# Altium schematic sheet USB.SchDoc
size A3; SheetNumber: 5; SheetTotal: 5
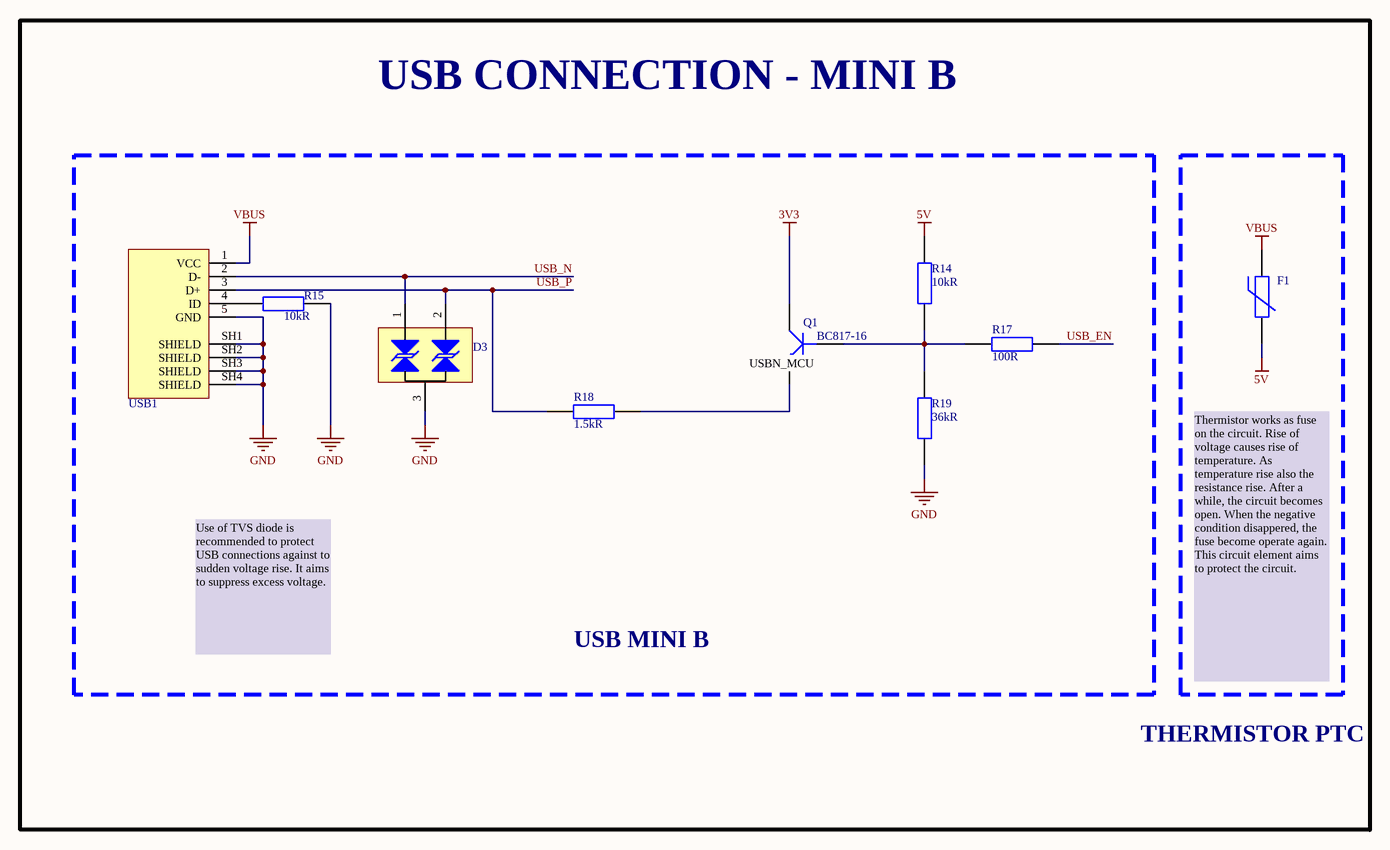
[diagram p0: USB.SchDoc]

## Parts
D3  SM712  [SOT-23]  (value not drawn)
F1  PRG21BC1R0MM1RA  [FUSE_0805]  (value not drawn)
Q1  BC817-16  [SOT23]
R14  Resistance: 10kR  [RES_0603]  (hidden comment: RC0603FR-0710KL)
R15  Resistance: 10kR  [RES_0603]  (hidden comment: RC0603FR-0710KL)
R17  Resistance: 100R  [RES_0603]  (hidden comment: RC0603JR-07100RL)
R18  Resistance: 1.5kR  [RES_0805]  (hidden comment: RC0805FR-071K5L)
R19  Resistance: 36kR  [RES_0805]  (hidden comment: RC0805FR-0736KL)
USB1  690-005-299-043  [MINI_USB_B]  (value not drawn)

## Blocks framed on the sheet
USB CONNECTION - MINI B: F1
USB MINI B: D3 Q1 R14 R15 R17-R19 USB1

## Nets
3V3: Q1.1(C)
5V: F1.2 R14.2
GND: D3.3 R15.2 R19.1 USB1.5(GND) USB1.SH1(SHIELD) USB1.SH2(SHIELD) USB1.SH3(SHIELD) USB1.SH4(SHIELD)
VBUS: F1.1 USB1.1(VCC)
USB_EN: R17.2
USB_N: D3.1 USB1.2(D-)
USB_P: D3.2 R18.1 USB1.3(D+)
NetQ1_2: Q1.2(B) R14.1 R17.1 R19.2
NetQ1_3: Q1.3(E) R18.2
NetR15_1: R15.1 USB1.4(ID)

## Notes on the sheet
- (near Q1) USBN_MCU
- Use of TVS diode is recommended to protect USB connections against to sudden voltage rise. It aims to suppress excess voltage.
- Thermistor works as fuse on the circuit. Rise of voltage causes rise of temperature. As temperature rise also the resistance rise. After a while, the circuit becomes open. When the negative condition disappered, the fuse become operate again.  This circuit element aims to protect the circuit.
- THERMISTOR PTC
- DOSYA ADI / FILE NAME
- TANIM / DESCRIPTION
- HAZIRLAYAN / PREPARED BY
- YAYIN TARİHİ / REL. DATE
- BOYUT / SIZE
- SAYFA / SHEET
- /

## Library data of the parts
D3 = SM712: 7V/12V Tvs, Package SOT-23, Tvs A; Manufacturer: Sangdest Microelectronics; DesignedBy: Aslı Kurt; Supplier 1: Digikey; Manufacturer Part Number: SM712; RoHS: No; Category: TVS Diodes; Stock 1: 85900; Pricing 1: 1=0,19, 10=0,132, 100=0,0887, 500=0,06778, 1000=0,06074 (USD); Supplier 2: Digikey; Stock 2: 84000; Pricing 2: 3000=0,05156, 6000=0,04684, 9000=0,04441, 15000=0,04165, 21000=0,04001, 30000=0,03841, 75000=0,03487, 150000=0,0339 (USD); Supplier Part Number 1: 1655-SM712CT-ND; Supplier Part Number 2: 1655-SM712TR-ND
F1 = PRG21BC1R0MM1RA: Thermistor PTC 1 Ohm 20% 2-Pin 0805 Surface Mount Solder Pad Embossed T/R; Manufacturer: Murata; DesignedBy: Aslı Kurt; Voltage Rating: 12V; Supplier 1: Mouser; Manufacturer Part Number: PRG21BC1R0MM1RA; RoHS: Yes; Category: Thermistors; Stock 1: 2720; Pricing 1: 1=0,62, 10=0,479, 50=0,479, 100=0,419, 1000=0,336, 10000=0,231 (USD); Lead Free: 5697LeadFree; ComponentLink1URL: https://datasheet.ciiva.com/30488/0900766b81259d6c-30488358.pdf?src-supplier=Rs; ComponentLink1Description: https://datasheet.ciiva.com/30488/0900766b81259d6c-30488358.pdf?src-supplier=Rs; ComponentLink2URL: https://datasheet.ciiva.com/327/ntc-ptcthermistorsforautomotive-327122.pdf?src-supplier=Digikey; ComponentLink2Description: https://datasheet.ciiva.com/327/ntc-ptcthermistorsforautomotive-327122.pdf?src-supplier=Digikey; ComponentLink3URL: https://datasheet.ciiva.com/29603/s0363e-29603286.pdf?src-supplier=Digikey; ComponentLink3Description: https://datasheet.ciiva.com/29603/s0363e-29603286.pdf?src-supplier=Digikey; ComponentLink4URL: https://datasheet.ciiva.com/29603/s0363e-29603287.pdf?src-supplier=Digikey; ComponentLink4Description: https://datasheet.ciiva.com/29603/s0363e-29603287.pdf?src-supplier=Digikey; ComponentLink5URL: https://datasheet.ciiva.com/29603/s0363e-29603289.pdf?src-supplier=Digikey; ComponentLink5Description: https://datasheet.ciiva.com/29603/s0363e-29603289.pdf?src-supplier=Digikey; ComponentLink6URL: https://datasheet.ciiva.com/3282/r90e-3282510.pdf?src-supplier=Avnet; ComponentLink6Description: https://datasheet.ciiva.com/3282/r90e-3282510.pdf?src-supplier=Avnet; Supplier 2: Arrow Electronics; Stock 2: 3860; Pricing 2: 387=0,3643, 1000=0,3353, 4000=0,2764 (USD); Supplier 3: Digikey; Stock 3: 24892; Pricing 3: 1=0,73, 5=0,612, 10=0,568, 25=0,5156, 50=0,4788, 100=0,4449, 500=0,37522, 1000=0,3487 (USD); Supplier 4: Digikey; Stock 4: 24892; Pricing 4: 1=0,73, 5=0,612, 10=0,568, 25=0,5156, 50=0,4788, 100=0,4449, 500=0,37522, 1000=0,3487 (USD); Supplier 5: Digikey; Stock 5: 24000; Pricing 5: 4000=0,23392, 8000=0,23138 (USD); Supplier Part Number 1: 81-PRG21BC1R0MM1RA; Supplier Part Number 2: PRG21BC1R0MM1RA; Supplier Part Number 3: 490-8511-1-ND; Supplier Part Number 4: 490-8511-6-ND; Supplier Part Number 5: 490-8511-2-ND
Q1 = BC817-16: ON Semi BC817-16LT1G NPN Bipolar Transistor; 0.5 A; 45 V; 3-Pin SOT-23; Manufacturer: ON Semiconductor; Max Collector Current: 500mA; Collector Base Voltage (VCBO): 50V; Emitter Base Voltage (VEBO): 5V; Collector Emitter Saturation Voltage: 700mV; Collector Emitter Breakdown Voltage: 45V; Max Power Dissipation: 300mW; Gain Bandwidth Product: 100MHz; Output Voltage: 15V; DesignedBy: Aslı Kurt; Supplier 1: Future Electronics; Manufacturer Part Number: BC817-16LT1G; RoHS: Yes; Category: BJTs; Stock 1: 63000; Pricing 1: 3000=0,0209, 12000=0,02, 30000=0,0147, 45000=0,0192, 75000=0,0143, 120000=0,0186, 300000=0,0177 (USD); Case/Package: SOT-23-3; Number of Pins: 3; Weight: 0.001058oz; Min Operating Temperature: -55°C; Max Operating Temperature: 150°C; Package Quantity: 3000; Packaging: Tape and Reel; Polarity: NPN; Collector-emitter Voltage-Max: 700mV; Series: -; Transition Frequency: 100MHz; Max Breakdown Voltage: 45V; Voltage Rating (DC): 45V; Current Rating: 500mA; Continuous Collector Current: 500mA; Length: 2.9mm; Width: 1.3mm; Height: 0.94mm; RoHS Compliant: Yes; Lead Free: Lead Free; Halogen Free: Halogen Free; Supplier 2: Avnet; Stock 2: 3965; Pricing 2: 1=0,158, 25=0,097, 50=0,079, 100=0,06, 250=0,052 (USD); Supplier 3: Arrow Electronics; Stock 3: 75000; Pricing 3: 3000=0,0223, 9000=0,016, 99000=0,0133 (USD); Supplier 4: Rs; Stock 4: 73400; Pricing 4: 1000=0,033, 2000=0,028 (GBP); Supplier 5: Rs; Stock 5: 2400; Pricing 5: 200=0,013, 1000=0,033, 2000=0,028 (GBP); Supplier 6: Digikey; Stock 6: 15878; Pricing 6: 1=0,1, 10=0,066, 100=0,0444, 500=0,03362, 1000=0,02993, 3000=0,02508, 6000=0,02256, 9000=0,02126, 15000=0,01978, 21000=0,0189, 30000=0,01803, 75000=0,01612, 150000=0,01492, 300000=0,0139 (USD); Supplier 7: Digikey; Stock 7: 16878; Pricing 7: 1=0,1, 10=0,066, 100=0,0444, 500=0,03362, 1000=0,02993 (USD); Supplier Part Number 1: 6937544; Supplier Part Number 2: 98H0503; Supplier Part Number 3: BC817-16LT1G; Supplier Part Number 4: 463616P; Supplier Part Number 5: 463616; Supplier Part Number 6: BC817-16LT1GOSCT-ND; Supplier Part Number 7: BC817-16LT1GOSDKR-ND
R14 R15 = RES 10K OHM 0603: RES 10K %1 OHM 0603 SMD; Manufacturer: Yageo; DesignedBy: Aslı Kurt; Tolerance: 1%; Temperature Coefficient: 100ppm/°C; Voltage Rating (DC): 50V; Power Rating: 100mW; Voltage Rating: 75V; Supplier 1: Digi-Key; Manufacturer Part Number: RC0603FR-0710KL; RoHS: Yes; Category: Chip SMD Resistors; Stock 1: 24140601; Pricing 1: 1=0,10000, 10=0,02300, 100=0,00930, 1000=0,00417, 2500=0,00362 (USD); Case/Package: 0603; Number of Pins: 2; Case Code (Imperial): 0603; Case Code (Metric): 1608; Weight: 7.1E-05oz; Size Code: 0603; Min Operating Temperature: -55°C; Max Operating Temperature: 155°C; Resistor Type: Thick Film; Packaging: Tape and Reel; Termination: SMD/SMT; Features: Moisture Resistant; Series: RC; Max Power Dissipation: 100mW; Number of Terminations: 2; Resistance Tolerance: 1%; Construction: Rectangular; Length: 1.6mm; Width: 0.8mm; Height: 0.45mm; Depth: 0.8mm; Lead Pitch: 0.3mm; REACH SVHC: Unknown; Lead Free: Lead Free; Military Standard: Not; RoHS Compliant: Yes; ComponentLink1URL: https://datasheet.ciiva.com/7660/38590-7660789.pdf?src-supplier=Element14; ComponentLink1Description: https://datasheet.ciiva.com/7660/38590-7660789.pdf?src-supplier=Element14; ComponentLink2URL: https://datasheet.ciiva.com/15189/getdatasheetpartid-409289-15189591.pdf?src-supplier=Verical; ComponentLink2Description: https://datasheet.ciiva.com/15189/getdatasheetpartid-409289-15189591.pdf?src-supplier=Verical; ComponentLink3URL: https://datasheet.ciiva.com/46440/1868787-46440891.pdf?src-supplier=Element14; ComponentLink3Description: https://datasheet.ciiva.com/46440/1868787-46440891.pdf?src-supplier=Element14; ComponentLink4URL: https://datasheet.ciiva.com/7983/443971-7983596.pdf?src-supplier=Element14; ComponentLink4Description: https://datasheet.ciiva.com/7983/443971-7983596.pdf?src-supplier=Element14; ComponentLink5URL: https://datasheet.ciiva.com/7746/1738695-7746239.pdf?src-supplier=Element14; ComponentLink5Description: https://datasheet.ciiva.com/7746/1738695-7746239.pdf?src-supplier=Element14; ComponentLink6URL: https://datasheet.ciiva.com/22747/443971-22747519.pdf?src-supplier=Element14; ComponentLink6Description: https://datasheet.ciiva.com/22747/443971-22747519.pdf?src-supplier=Element14; Supplier Part Number 1: 311-10.0KHRCT-ND
R17 = RES 100 OHM 0603: RES 100 %5 OHM 0603 SMD; Manufacturer: Yageo; DesignedBy: Aslı Kurt; Tolerance: 5%; Temperature Coefficient: 100ppm/°C; Voltage Rating (DC): 50V; Power Rating: 100mW; Supplier 1: Digi-Key; Manufacturer Part Number: RC0603JR-07100RL; RoHS: Yes; Category: Chip SMD Resistors; Stock 1: 4334796; Pricing 1: 1=0,10000, 10=0,01900, 100=0,00770, 1000=0,00344, 2500=0,00298 (USD); Case/Package: 0603; Number of Pins: 2; Contact Plating: Tin,Matte; Case Code (Imperial): 0603; Case Code (Metric): 1608; Size Code: 0603; Min Operating Temperature: -55°C; Max Operating Temperature: 155°C; Resistor Type: Thick Film; Packaging: Tape and Reel; Voltage Rating: 50V; Termination: SMD/SMT; Features: Moisture Resistant; Series: RC; Max Power Dissipation: 100mW; Number of Terminations: 2; Construction: Rectangular; Resistance Tolerance: 5%; Length: 1.6mm; Width: 0.8mm; Depth: 0.8mm; Radiation Hardening: No; REACH SVHC: Unknown; Lead Free: Lead Free; Military Standard: Not; RoHS Compliant: Yes; ComponentLink1URL: https://datasheet.ciiva.com/15189/getdatasheetpartid-325207-15189846.pdf?src-supplier=Verical; ComponentLink1Description: https://datasheet.ciiva.com/15189/getdatasheetpartid-325207-15189846.pdf?src-supplier=Verical; ComponentLink2URL: https://datasheet.ciiva.com/8883/pyu-rc0603-51-rohs-l-4-8883047.pdf?src-supplier=Avnet; ComponentLink2Description: https://datasheet.ciiva.com/8883/pyu-rc0603-51-rohs-l-4-8883047.pdf?src-supplier=Avnet; ComponentLink3URL: https://datasheet.ciiva.com/7746/443971-7746425.pdf?src-supplier=Element14; ComponentLink3Description: https://datasheet.ciiva.com/7746/443971-7746425.pdf?src-supplier=Element14; ComponentLink4URL: https://datasheet.ciiva.com/7746/443971-7746426.pdf?src-supplier=Element14; ComponentLink4Description: https://datasheet.ciiva.com/7746/443971-7746426.pdf?src-supplier=Element14; Supplier Part Number 1: 311-100GRCT-ND
R18 = RES 1K5 OHM 0805: SMD Chip Resistor, 1.5 kOhm, ï¿½ 1%, 125 mW, 0805 [2012 Metric], Thick Film, General Purpose; Manufacturer: Yageo; Temperature Coefficient: 100ppm/°C; Voltage Rating: 150V; Power Rating: 125mW; DesignedBy: Aslı Kurt; Supplier 1: Future Electronics; Manufacturer Part Number: RC0805FR-071K5L; RoHS: Yes; Category: Chip SMD Resistors; Stock 1: 1590000; Pricing 1: 5000=0,0041, 25000=0,0039, 100000=0,0038, 250000=0,0037, 625000=0,0035 (USD); Case/Package: 0805; Case Code (Imperial): 0805; Case Code (Metric): 2012; Size Code: 0805; Min Operating Temperature: -55°C; Max Operating Temperature: 155°C; Tolerance: 1%; Packaging: Tape and Reel; Resistor Type: Thick Film; Package Quantity: 5000; Termination: SMD/SMT; Series: RC; Voltage Rating (AC): 150V; Features: Moisture Resistant; Max Power Dissipation: 125mW; Number of Terminations: 2; Resistance Tolerance: 1%; Length: 2mm; Width: 1.25mm; Height: 0.5mm; Lead Free: Lead Free; Reach SVHC Compliant: Unknown; RoHS Compliant: Yes; ComponentLink1URL: https://datasheet.ciiva.com/17423/rc0805-17423247.pdf?src-supplier=Future+Electronics; ComponentLink1Description: https://datasheet.ciiva.com/17423/rc0805-17423247.pdf?src-supplier=Future+Electronics; Supplier 2: Avnet; Stock 2: 10000; Pricing 2: 5000=0,00207 (USD); Supplier 3: Farnell; Stock 3: 120909; Pricing 3: 500=0,0091, 1000=0,0072, 2500=0,0071 (EUR); Supplier 4: Rs; Stock 4: 13600; Pricing 4: 100=0,008, 1000=0,004, 2500=0,004, 5000=0,003, 10000=0,003 (GBP); Supplier 5: Mouser; Stock 5: 365697; Pricing 5: 1=0,1, 10=0,016, 50=0,016, 100=0,01, 1000=0,007, 10000=0,004 (USD); Supplier 6: Digikey; Stock 6: 528695; Pricing 6: 1=0,1, 10=0,016, 50=0,0132, 500=0,0102, 1000=0,00714 (USD); Supplier Part Number 1: 4797627; Supplier Part Number 2: RC0805FR-071K5L; Supplier Part Number 3: 9237518RL; Supplier Part Number 4: 1995669; Supplier Part Number 5: 603-RC0805FR-071K5L; Supplier Part Number 6: 311-1.50KCRDKR-ND
R19 = RES 36K OHM 0805: SMD Chip Resistor, 36 kOhm, ± 1%, 125 mW, 0805 [2012 Metric], Thick Film, General Purpose; Manufacturer: Yageo; Power Rating: 125mW; Voltage Rating: 150V; Temperature Coefficient: 100ppm/°C; DesignedBy: Aslı Kurt; Supplier 1: Future Electronics; Manufacturer Part Number: RC0805FR-0736KL; RoHS: Yes; Category: Chip SMD Resistors; Stock 1: 215000; Pricing 1: 5000=0,0031, 25000=0,0029, 100000=0,0028, 250000=0,0027, 625000=0,0026 (USD); Case/Package: 0805; Case Code (Imperial): 0805; Case Code (Metric): 2012; Min Operating Temperature: -55°C; Max Operating Temperature: 155°C; Tolerance: 1%; Packaging: Tape and Reel; Termination: SMD/SMT; Features: Moisture Resistant; Series: RC; Max Power Dissipation: 125mW; Number of Terminations: 2; Voltage Rating (DC): 150V; RoHS Compliant: Yes; Lead Free: 5697LeadFree; ComponentLink1URL: http://www.mouser.com/ds/2/447/Yageo_08112016_RC0805-968729.pdf?src-supplier=Mouser; ComponentLink1Description: http://www.mouser.com/ds/2/447/Yageo_08112016_RC0805-968729.pdf?src-supplier=Mouser; ComponentLink2URL: https://datasheet.octopart.com/RC0805FR-0736KL-Yageo-datasheet-164759695.pdf?src-supplier=Future+Electronics; ComponentLink2Description: https://datasheet.octopart.com/RC0805FR-0736KL-Yageo-datasheet-164759695.pdf?src-supplier=Future+Electronics; ComponentLink3URL: http://www.yageo.com/documents/recent/PYu-RC_Group_51_RoHS_L_9.pdf?src-supplier=Digikey; ComponentLink3Description: http://www.yageo.com/documents/recent/PYu-RC_Group_51_RoHS_L_9.pdf?src-supplier=Digikey; ComponentLink4URL: https://datasheet.octopart.com/RC0805FR-0736KL-Yageo-datasheet-118657.pdf?src-supplier=Digikey; ComponentLink4Description: https://datasheet.octopart.com/RC0805FR-0736KL-Yageo-datasheet-118657.pdf?src-supplier=Digikey; Supplier 2: Arrow Electronics; Stock 2: 20000; Pricing 2: 5000=0,0044, 10000=0,0038, 50000=0,0035, 250000=0,0032, 500000=0,0031 (USD); Supplier 3: Farnell; Stock 3: 8818; Pricing 3: 10=0,013, 100=0,008, 500=0,007, 1000=0,006, 2500=0,0055, 5000=0,005, 25000=0,004, 50000=0,0039 (EUR); Supplier 4: Mouser; Stock 4: 76809; Pricing 4: 1=0,1, 10=0,012, 50=0,012, 100=0,007, 1000=0,006, 10000=0,005 (USD); Supplier 5: Digikey; Stock 5: 212494; Pricing 5: 1=0,1, 10=0,016, 50=0,0132, 500=0,0102, 1000=0,00714 (USD); Supplier Part Number 1: 1143922; Supplier Part Number 2: RC0805FR-0736KL; Supplier Part Number 3: 3496035; Supplier Part Number 4: 603-RC0805FR-0736KL; Supplier Part Number 5: 311-36.0KCRCT-ND
USB1 = 690-005-299-043: Conn Mini USB 2.0 Type B RCP 5 POS 0.8mm Solder RA SMD 5 Terminal 1 Port; Manufacturer: EDAC; Number of Contacts: 5; Gender: Receptacle; Number of Ports: 1; Mating Cycles: 1500; Shielding: Unshielded; DesignedBy: Aslı Kurt; Supplier 1: Mouser; Manufacturer Part Number: 690-005-299-043; RoHS: No; Category: USB Connectors; Stock 1: 13065; Pricing 1: 1=0,71, 10=0,476, 50=0,476, 100=0,397, 1000=0,337, 10000=0,27 (USD); Mount: Surface Mount,Horizontal; Color: Black; Contact Material: Bronze; Contact Plating: Gold; Housing Material: Thermoplastic; Insulation Color: Black; Min Operating Temperature: -30°C; Max Operating Temperature: 80°C; Packaging: Cut Tape; Connector Type: USB; Termination: Solder; Orientation: Right Angle; Series: 690; Pitch: 0.8mm; Lead Free: Lead Free; Flammability Rating: UL94 V-0; ComponentLink1URL: https://datasheet.ciiva.com/30246/690-005-299-043-30246515.pdf?src-supplier=Onlinecomponents.com; ComponentLink1Description: https://datasheet.ciiva.com/30246/690-005-299-043-30246515.pdf?src-supplier=Onlinecomponents.com; ComponentLink2URL: https://datasheet.ciiva.com/29660/690-005-299-043-29660027.pdf?src-supplier=Digikey; ComponentLink2Description: https://datasheet.ciiva.com/29660/690-005-299-043-29660027.pdf?src-supplier=Digikey; ComponentLink3URL: https://datasheet.ciiva.com/29660/690-005-299-043-29660028.pdf?src-supplier=Digikey; ComponentLink3Description: https://datasheet.ciiva.com/29660/690-005-299-043-29660028.pdf?src-supplier=Digikey; ComponentLink4URL: https://datasheet.ciiva.com/29660/690-005-299-043-29660029.pdf?src-supplier=Digikey; ComponentLink4Description: https://datasheet.ciiva.com/29660/690-005-299-043-29660029.pdf?src-supplier=Digikey; Supplier 2: Digikey; Stock 2: 62687; Pricing 2: 1=0,75, 10=0,573, 25=0,5148, 50=0,4754, 100=0,4392, 250=0,39636, 500=0,36736 (USD); Supplier 3: Digikey; Stock 3: 62687; Pricing 3: 1=0,75, 10=0,573, 25=0,5148, 50=0,4754, 100=0,4392, 250=0,39636, 500=0,36736 (USD); Supplier 4: Digikey; Stock 4: 62000; Pricing 4: 1000=0,34102, 2000=0,31713, 3000=0,3042, 5000=0,28894, 7000=0,27949, 10000=0,26996, 25000=0,25 (USD); Supplier Part Number 1: 587-690-005-299-043; Supplier Part Number 2: 151-1206-1-ND; Supplier Part Number 3: 151-1206-6-ND; Supplier Part Number 4: 151-1206-2-ND